# Altium schematic sheet BMS.SchDoc
size A4; SheetNumber: 3; SheetTotal: 5
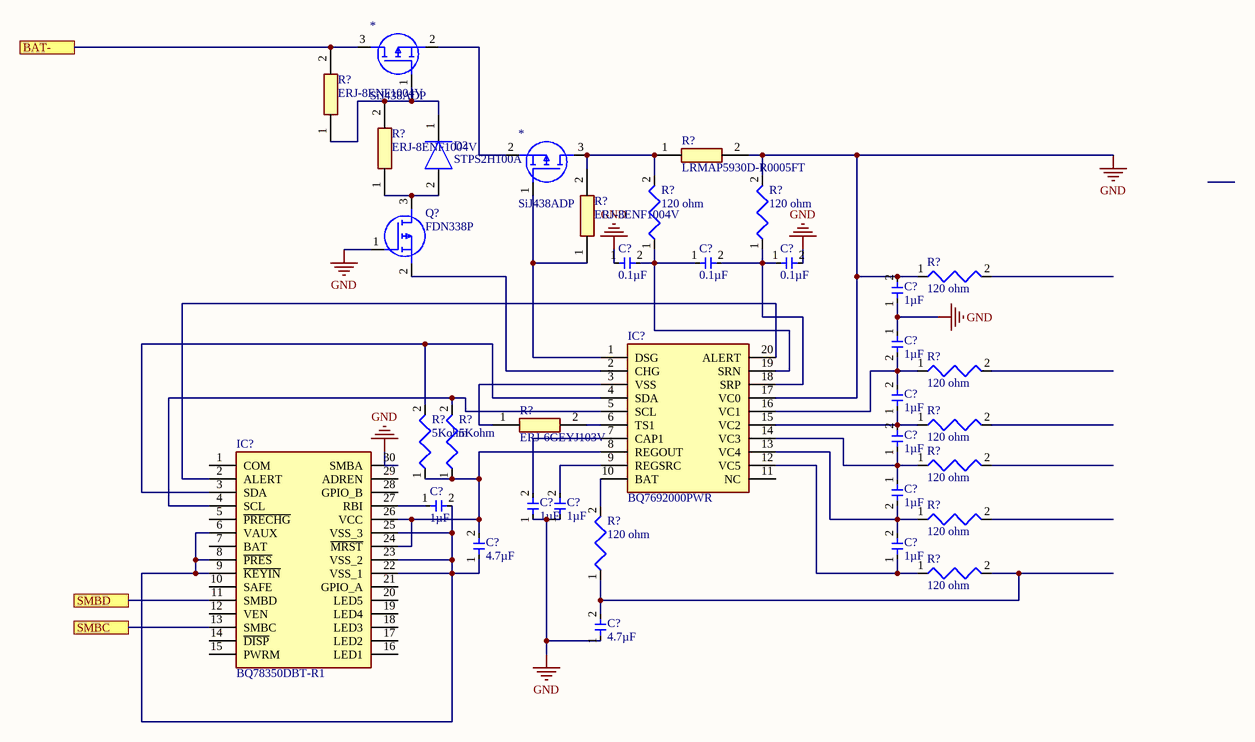
[diagram p0: BMS.SchDoc]

## Parts
(Parts that share a designator on the sheet are numbered #1, #2 ... from top to bottom, then left to right.)
*#1  SiJ438ADP
*#2  SiJ438ADP
C?#1  0.1µF  [0603]
C?#2  0.1µF  [0603]
C?#3  0.1µF  [0603]
C?#4  1µF  [0603]
C?#5  1µF  [0603]
C?#6  1µF  [0603]
C?#7  1µF  [0603]
C?#8  1µF  [0603]
C?#9  1µF  [0603]
C?#10  1µF  [0603]
C?#11  1µF  [0603]
C?#12  4.7µF  [0603]
C?#13  1µF  [0603]
C?#14  4.7µF  [0603]
D?  STPS2H100A  [DIOM5126X265N]
IC?#1  BQ7692000PWR  [SOP65P640X120-20N]
IC?#2  BQ78350DBT-R1  [SOP50P640X120-30N]
Q?  FDN338P  [SOT95P237X112-3N]
R?#1  ERJ-8ENF1004V  [RESC3116X70N]
R?#2  LRMAP5930D-R0005FT  [RESC15078X157N]
R?#3  ERJ-8ENF1004V  [RESC3116X70N]
R?#4  120 ohm  [CRCW0603]
R?#5  120 ohm  [CRCW0603]
R?#6  ERJ-8ENF1004V  [RESC3116X70N]
R?#7  120 ohm  [CRCW0603]
R?#8  120 ohm  [CRCW0603]
R?#9  ERJ-6GEYJ103V  [RESC2012X70N]
R?#10  120 ohm  [CRCW0603]
R?#11  5Kohm  [ERJ-2RK]
R?#12  5Kohm  [ERJ-2RK]
R?#13  120 ohm  [CRCW0603]
R?#14  120 ohm  [CRCW0603]
R?#15  120 ohm  [CRCW0603]
R?#16  120 ohm  [CRCW0603]

## Ports
BAT-, SMBC, SMBD

## Nets
GND: C?#1.1 C?#3.2 C?#4.1 C?#4.2 C?#5.1 C?#10.1 C?#11.1 C?#14.1 IC?#1.17(VC0) IC?#2.30(SMBA) Q?.1(G) R?#2.2 R?#5.2 R?#7.1
BAT-: *#1.3(D) R?#1.2 ; port BAT-
SMBC: IC?#2.13(SMBC) ; port SMBC
SMBD: IC?#2.11(SMBD) ; port SMBD
Net*#1_1: *#1.1(G) D?.1(K) R?#1.1 R?#3.2
Net*#1_2: *#1.2(S) *#2.2(S)
Net*#2_1: *#2.1(G) IC?#1.1(DSG) R?#6.1
Net*#2_3: *#2.3(D) R?#2.1 R?#4.2 R?#6.2
NetC?#1_2: C?#1.2 C?#2.1 IC?#1.19(SRN) R?#4.1
NetC?#2_2: C?#2.2 C?#3.1 IC?#1.18(SRP) R?#5.1
NetC?#5_2: C?#5.2 C?#6.2 IC?#1.16(VC1) R?#8.1
NetC?#6_1: C?#6.1 C?#7.2 IC?#1.15(VC2) R?#10.1
NetC?#7_1: C?#7.1 C?#8.1 IC?#1.14(VC3) R?#13.1
NetC?#8_2: C?#8.2 C?#13.2 IC?#1.13(VC4) R?#14.1
NetC?#9_1: C?#9.1 IC?#2.27(RBI)
NetC?#9_2: C?#9.2 C?#12.1 IC?#2.6(VAUX) IC?#2.8(~{PRES}) IC?#2.9(~{KEYIN}) IC?#2.22(VSS_1) IC?#2.23(VSS_2) IC?#2.25(VSS_3)
NetC?#10_2: C?#10.2 IC?#1.7(CAP1)
NetC?#11_2: C?#11.2 IC?#1.9(REGSRC)
NetC?#12_2: C?#12.2 IC?#1.8(REGOUT) IC?#2.24(~{MRST}) IC?#2.26(VCC) R?#11.1 R?#12.1
NetC?#13_1: C?#13.1 IC?#1.12(VC5) R?#16.1
NetC?#14_2: C?#14.2 R?#15.1 R?#16.2
NetD?_2: D?.2(A) Q?.3(D) R?#3.1
NetIC?#1_2: IC?#1.2(CHG) Q?.2(S)
NetIC?#1_3: IC?#1.3(VSS) R?#9.1
NetIC?#1_4: IC?#1.4(SDA) IC?#2.3(SDA) R?#11.2
NetIC?#1_5: IC?#1.5(SCL) IC?#2.4(SCL) R?#12.2
NetIC?#1_6: IC?#1.6(TS1) R?#9.2
NetIC?#1_10: IC?#1.10(BAT) R?#15.2
NetIC?#1_20: IC?#1.20(ALERT) IC?#2.2(ALERT)

Not connected (* = marked no-connect by the designer): IC?#1 11(NC); IC?#2 1(COM) 5(~{PRECHG}) 7(BAT) 10(SAFE) 12(VEN) 14(~{DISP}) 15(PWRM) 16(LED1) 17(LED2) 18(LED3) 19(LED4) 20(LED5) 21(GPIO_A) 28(GPIO_B) 29(ADREN); R?#7 2; R?#8 2; R?#10 2; R?#13 2; R?#14 2

## Library data of the parts
C?#1-C?#3 = 0603YC104KAT2A: Cap Ceramic 0.1uF 16V X7R 10% SMD 0603 125C Paper T/R; Manufacturer: Kyocera AVX; Capacitance: 100nF; Insulation Resistance: 100GR; Dissipation Factor: 3.5%; Supplier 1: Farnell; Manufacturer Part Number: 0603YC104KAT2A; RoHS: Yes; Category: Ceramic Capacitors; Stock 1: 61599; Pricing 1: 10=0.06680, 100=0.05510, 500=0.03380, 1000=0.02430, 2000=0.02420, 4000=0.01760, 20000=0.01470 (EUR); Mount: Surface Mount,PCB; Case/Package: 0603; Number of Pins: 2; Case Code (Metric): 1608; Case Code (Imperial): 0603; Contact Plating: Tin,Matte; Min Operating Temperature: -55°C; Max Operating Temperature: 125°C; Tolerance: 10%; Dielectric: X7R; Packaging: Tape and Reel; Voltage Rating (DC): 16V; Voltage: 16V; Voltage Rating: 16V; Package Quantity: 1; Termination: SMD/SMT; Series: -; Construction: Flat; Length: 1.6mm; Width: 0.032inch; Height: 0.9mm; Depth: 0.81mm; Thickness: 0.035inch; Radiation Hardening: No; REACH SVHC: No SVHC; Lead Free: Lead Free; RoHS Compliant: Yes; ComponentLink1URL: https://datasheet.ciiva.com/11788/0900766b80dc2409-11788525.pdf?src-supplier=RSComponents; ComponentLink1Description: https://datasheet.ciiva.com/11788/0900766b80dc2409-11788525.pdf?src-supplier=RSComponents; ComponentLink2URL: https://datasheet.ciiva.com/1458/84526-1458128.pdf?src-supplier=Element14; ComponentLink2Description: https://datasheet.ciiva.com/1458/84526-1458128.pdf?src-supplier=Element14; ComponentLink3URL: https://datasheet.ciiva.com/1458/84526-1458129.pdf?src-supplier=Element14; ComponentLink3Description: https://datasheet.ciiva.com/1458/84526-1458129.pdf?src-supplier=Element14; ComponentLink4URL: https://datasheet.ciiva.com/150/cx7r-150230.pdf?src-supplier=Digi-Key; ComponentLink4Description: https://datasheet.ciiva.com/150/cx7r-150230.pdf?src-supplier=Digi-Key; ComponentLink5URL: https://datasheet.ciiva.com/28613/683218-28613286.pdf?src-supplier=Element14; ComponentLink5Description: https://datasheet.ciiva.com/28613/683218-28613286.pdf?src-supplier=Element14; ComponentLink6URL: https://datasheet.ciiva.com/150/cx7r-150231.pdf?src-supplier=Digi-Key; ComponentLink6Description: https://datasheet.ciiva.com/150/cx7r-150231.pdf?src-supplier=Digi-Key; ComponentLink7URL: https://datasheet.ciiva.com/150/cx7r-150232.pdf?src-supplier=Digi-Key; ComponentLink7Description: https://datasheet.ciiva.com/150/cx7r-150232.pdf?src-supplier=Digi-Key; ComponentLink8URL: https://datasheet.ciiva.com/5427/cx7r-218113-5427486.pdf?src-supplier=Mouser; ComponentLink8Description: https://datasheet.ciiva.com/5427/cx7r-218113-5427486.pdf?src-supplier=Mouser; ComponentLink9URL: https://datasheet.ciiva.com/14585/70001075-14585102.pdf?src-supplier=Allied+Electronics; ComponentLink9Description: https://datasheet.ciiva.com/14585/70001075-14585102.pdf?src-supplier=Allied+Electronics; ComponentLink10URL: https://datasheet.ciiva.com/11464/cx7r-11464543.pdf?src-supplier=Avnet; ComponentLink10Description: https://datasheet.ciiva.com/11464/cx7r-11464543.pdf?src-supplier=Avnet; Supplier Part Number 1: 1327679
C?#4-C?#11 C?#13 = 0603YD105KAT2A: AVX - 0603YD105KAT2A - SMD Multilayer Ceramic Capacitor, 1 µF, 16 V, 0603 [1608 Metric], ± 10%, X5R, AVX 0603 MLCC; Manufacturer: Kyocera AVX; Capacitance: 1uF; Voltage Rating: 16V; Dissipation Factor: 12.5%; Insulation Resistance: 10GR; Supplier 1: Farnell; Manufacturer Part Number: 0603YD105KAT2A; RoHS: Yes; Category: Ceramic Capacitors; Stock 1: 33961; Pricing 1: 10=0.07550, 100=0.05170, 500=0.03710, 1000=0.03000, 2000=0.02970, 4000=0.02940, 20000=0.02000 (EUR); Mount: Surface Mount; Case/Package: 0603; Number of Pins: 2; Case Code (Metric): 1608; Case Code (Imperial): 0603; Min Operating Temperature: -55°C; Max Operating Temperature: 85°C; Tolerance: 10%; Dielectric: X5R; Voltage Rating (DC): 16V; Packaging: Tape and Reel; Voltage: 16V; Package Quantity: 1; Termination: SMD/SMT; Series: -; Construction: Flat; Length: 1.6mm; Width: 0.81mm; Height: 0.9mm; Depth: 0.81mm; Thickness: 0.035inch; Radiation Hardening: No; REACH SVHC: No SVHC; Lead Free: Lead Free; RoHS Compliant: Yes; ComponentLink1URL: https://datasheet.ciiva.com/11788/0900766b80def1a5-11788563.pdf?src-supplier=RSComponents; ComponentLink1Description: https://datasheet.ciiva.com/11788/0900766b80def1a5-11788563.pdf?src-supplier=RSComponents; ComponentLink2URL: https://datasheet.ciiva.com/34303/2012654-34303835.pdf?src-supplier=Jameco; ComponentLink2Description: https://datasheet.ciiva.com/34303/2012654-34303835.pdf?src-supplier=Jameco; ComponentLink3URL: https://datasheet.ciiva.com/2987/cx5r-2987890.pdf?src-supplier=Avnet; ComponentLink3Description: https://datasheet.ciiva.com/2987/cx5r-2987890.pdf?src-supplier=Avnet; ComponentLink4URL: https://datasheet.ciiva.com/5412/cx5r-5412550.pdf?src-supplier=Mouser; ComponentLink4Description: https://datasheet.ciiva.com/5412/cx5r-5412550.pdf?src-supplier=Mouser; ComponentLink5URL: https://datasheet.ciiva.com/150/cx5r-150392.pdf?src-supplier=Digi-Key; ComponentLink5Description: https://datasheet.ciiva.com/150/cx5r-150392.pdf?src-supplier=Digi-Key; ComponentLink6URL: https://datasheet.ciiva.com/14590/70001028-14590632.pdf?src-supplier=Allied+Electronics; ComponentLink6Description: https://datasheet.ciiva.com/14590/70001028-14590632.pdf?src-supplier=Allied+Electronics; ComponentLink7URL: https://datasheet.ciiva.com/150/cx5r-150393.pdf?src-supplier=Digi-Key; ComponentLink7Description: https://datasheet.ciiva.com/150/cx5r-150393.pdf?src-supplier=Digi-Key; ComponentLink8URL: https://datasheet.ciiva.com/1458/84508-1458137.pdf?src-supplier=Element14; ComponentLink8Description: https://datasheet.ciiva.com/1458/84508-1458137.pdf?src-supplier=Element14; ComponentLink9URL: https://datasheet.ciiva.com/150/cx5r-150394.pdf?src-supplier=Digi-Key; ComponentLink9Description: https://datasheet.ciiva.com/150/cx5r-150394.pdf?src-supplier=Digi-Key; ComponentLink10URL: https://datasheet.ciiva.com/1458/84508-1458138.pdf?src-supplier=Element14; ComponentLink10Description: https://datasheet.ciiva.com/1458/84508-1458138.pdf?src-supplier=Element14; ComponentLink11URL: https://datasheet.ciiva.com/14586/70001028-14586715.pdf?src-supplier=Allied+Electronics; ComponentLink11Description: https://datasheet.ciiva.com/14586/70001028-14586715.pdf?src-supplier=Allied+Electronics; Supplier Part Number 1: 1327680
C?#12 C?#14 = 0603ZD475KAT2A: AVX - 0603ZD475KAT2A - SMD Multilayer Ceramic Capacitor, 4.7 µF, 10 V, 0603 [1608 Metric], ± 10%, X5R, AVX 0603 MLCC; Manufacturer: Kyocera AVX; Capacitance: 4.7uF; Voltage Rating: 10V; Dissipation Factor: 3.5%; Supplier 1: Farnell; Manufacturer Part Number: 0603ZD475KAT2A; RoHS: Yes; Category: Ceramic Capacitors; Stock 1: 14307; Pricing 1: 10=0.39800, 100=0.22700, 500=0.14700, 1000=0.11700, 2000=0.09810, 4000=0.08400, 20000=0.05250 (EUR); Mount: Surface Mount; Case/Package: 0603; Number of Pins: 2; Case Code (Imperial): 0603; Case Code (Metric): 1608; Contact Plating: Tin,Matte; Min Operating Temperature: -55°C; Max Operating Temperature: 85°C; Tolerance: 10%; Dielectric: X5R; Package Quantity: 1; Voltage Rating (DC): 10V; Packaging: Tape and Reel; Termination: SMD/SMT; Series: -; Voltage: 10V; Construction: Flat; Length: 1.6mm; Width: 0.81mm; Height: 0.9mm; Depth: 0.81mm; Thickness: 0.035inch; Radiation Hardening: No; REACH SVHC: No SVHC; Lead Free: Lead Free; RoHS Compliant: Yes; ComponentLink1URL: https://datasheet.ciiva.com/1458/1796776-1458211.pdf?src-supplier=Element14; ComponentLink1Description: https://datasheet.ciiva.com/1458/1796776-1458211.pdf?src-supplier=Element14; ComponentLink2URL: https://datasheet.ciiva.com/15212/getdatasheetpartid-179504-15212405.pdf?src-supplier=Verical; ComponentLink2Description: https://datasheet.ciiva.com/15212/getdatasheetpartid-179504-15212405.pdf?src-supplier=Verical; ComponentLink3URL: https://datasheet.ciiva.com/11570/cx5r-11570838.pdf?src-supplier=Avnet; ComponentLink3Description: https://datasheet.ciiva.com/11570/cx5r-11570838.pdf?src-supplier=Avnet; ComponentLink4URL: https://datasheet.ciiva.com/6269/cx5r-6269191.pdf?src-supplier=Digi-Key; ComponentLink4Description: https://datasheet.ciiva.com/6269/cx5r-6269191.pdf?src-supplier=Digi-Key; ComponentLink5URL: https://datasheet.ciiva.com/14905/cx5r-14905225.pdf?src-supplier=Digi-Key; ComponentLink5Description: https://datasheet.ciiva.com/14905/cx5r-14905225.pdf?src-supplier=Digi-Key; ComponentLink6URL: https://datasheet.ciiva.com/7855/1666675-7855114.pdf?src-supplier=Element14; ComponentLink6Description: https://datasheet.ciiva.com/7855/1666675-7855114.pdf?src-supplier=Element14; ComponentLink7URL: https://datasheet.ciiva.com/14905/cx5r-14905226.pdf?src-supplier=Digi-Key; ComponentLink7Description: https://datasheet.ciiva.com/14905/cx5r-14905226.pdf?src-supplier=Digi-Key; ComponentLink8URL: https://datasheet.ciiva.com/7614/cx5r-7614716.pdf?src-supplier=Digi-Key; ComponentLink8Description: https://datasheet.ciiva.com/7614/cx5r-7614716.pdf?src-supplier=Digi-Key; ComponentLink9URL: https://datasheet.ciiva.com/28611/1598274-28611548.pdf?src-supplier=Element14; ComponentLink9Description: https://datasheet.ciiva.com/28611/1598274-28611548.pdf?src-supplier=Element14; ComponentLink10URL: https://datasheet.ciiva.com/22700/1796776-22700575.pdf?src-supplier=Element14; ComponentLink10Description: https://datasheet.ciiva.com/22700/1796776-22700575.pdf?src-supplier=Element14; Supplier Part Number 1: 1833806
D? = STPS2H100A: Diode; Manufacturer_Name: STMicroelectronics; Datasheet Link: https://componentsearchengine.com//STPS2H100A.pdf; Height: 2.65mm; Mouser2 Part Number: 511-STPS2H100A; Mouser2 Price/Stock: https://www.mouser.com/Search/Refine.aspx?Keyword=511-STPS2H100A; Manufacturer_Part_Number: STPS2H100A
IC?#1 = BQ7692000PWR: Integrated Circuit; Manufacturer_Name: Texas Instruments; Datasheet Link: http://www.ti.com/lit/gpn/bq76920; Height: 1.2mm; Manufacturer_Part_Number: BQ7692000PWR; Mouser Part Number: 595-BQ7692000PWR; Mouser Price/Stock: https://www.mouser.co.uk/ProductDetail/Texas-Instruments/BQ7692000PWR?qs=%2Fd%252BFzHvH4c0MjFeRoItEJg%3D%3D; Arrow Part Number: BQ7692000PWR; Arrow Price/Stock: https://www.arrow.com/en/products/bq7692000pwr/texas-instruments
IC?#2 = BQ78350DBT-R1: Integrated Circuit; Manufacturer_Name: Texas Instruments; Datasheet Link: http://www.ti.com/lit/ds/symlink/bq78350-r1.pdf; Height: 1.2mm; Manufacturer_Part_Number: BQ78350DBT-R1; Mouser Part Number: 595-BQ78350DBT-R1; Mouser Price/Stock: https://www.mouser.co.uk/ProductDetail/Texas-Instruments/BQ78350DBT-R1?qs=yajEpaT76uQsatHsVfjOmw%3D%3D; Arrow Part Number: BQ78350DBT-R1; Arrow Price/Stock: https://www.arrow.com/en/products/bq78350dbt-r1/texas-instruments
Q? = FDN338P: MOSFET (P-Channel); Manufacturer_Name: ON Semiconductor; Height: 1.12mm; Manufacturer_Part_Number: FDN338P
R?#1 R?#3 R?#6 = ERJ-8ENF1004V: Resistor; Manufacturer_Name: Panasonic; Datasheet Link: https://industrial.panasonic.com/cdbs/www-data/pdf/RDA0000/AOA0000C86.pdf; Height: 0.7mm; Manufacturer_Part_Number: ERJ-8ENF1004V
R?#2 = LRMAP5930D-R0005FT: Resistor; Manufacturer_Name: TT ELECTRONICS / WELWYN; Datasheet Link: https://componentsearchengine.com/Datasheets/2/LRMAP5930D-R0005FT.pdf; Height: 1.57mm; Manufacturer_Part_Number: LRMAP5930D-R0005FT
R?#4 R?#5 R?#7 R?#8 R?#10 R?#13-R?#16 = CRCW0603120RFKEA: Res Thick Film 0603 120 Ohm 1% 1/10W ±100ppm/°C Molded SMD Paper T/R; Manufacturer: Vishay; Resistance: 120R; Max Power Dissipation: 100mW; Voltage Rating: 75V; Supplier 1: Farnell; Manufacturer Part Number: CRCW0603120RFKEA; RoHS: Yes; Category: Chip SMD Resistors; Stock 1: 98285; Pricing 1: 10=0.02730, 100=0.01530, 500=0.01020, 1000=0.00500, 2500=0.00450, 5000=0.00390, 25000=0.00330 (EUR); Mount: Surface Mount; Case/Package: 0603; Case Code (Metric): 1608; Case Code (Imperial): 0603; Contact Plating: Tin; Weight: 7.1E-05oz; Min Operating Temperature: -55°C; Max Operating Temperature: 155°C; Tolerance: 1%; Resistor Type: Thick Film; Temperature Coefficient: 100ppm/°C; Packaging: Tape and Reel; Number of Terminations: 2; Package Quantity: 10; Power Rating: 100mW; Termination: SMD/SMT; Features: Automotive AEC-Q200; Series: CRCW; Technology: THICK FILM; Construction: Rectangular; Resistance Tolerance: 1%; Voltage Rating (DC): 75V; Working Voltage: 75V; Length: 1.55mm; Width: 0.033inch; Height: 0.45mm; Depth: 0.85mm; Radiation Hardening: No; RoHS Compliant: Yes; REACH SVHC: Unknown; Military Standard: Not; Lead Free: Lead Free; ComponentLink1URL: https://datasheet.ciiva.com/11811/0900766b80d98afc-11811523.pdf?src-supplier=RSComponents; ComponentLink1Description: https://datasheet.ciiva.com/11811/0900766b80d98afc-11811523.pdf?src-supplier=RSComponents; ComponentLink2URL: https://datasheet.ciiva.com/2513/dcrcwe3-2513575.pdf?src-supplier=Digi-Key; ComponentLink2Description: https://datasheet.ciiva.com/2513/dcrcwe3-2513575.pdf?src-supplier=Digi-Key; ComponentLink3URL: https://datasheet.ciiva.com/2513/dcrcwe3-2513576.pdf?src-supplier=Digi-Key; ComponentLink3Description: https://datasheet.ciiva.com/2513/dcrcwe3-2513576.pdf?src-supplier=Digi-Key; ComponentLink4URL: https://datasheet.ciiva.com/26316/fld-crcw-e3-data-en-26316568.pdf?src-supplier=Distrelec; ComponentLink4Description: https://datasheet.ciiva.com/26316/fld-crcw-e3-data-en-26316568.pdf?src-supplier=Distrelec; ComponentLink5URL: https://datasheet.ciiva.com/2513/dcrcwe3-2513577.pdf?src-supplier=Digi-Key; ComponentLink5Description: https://datasheet.ciiva.com/2513/dcrcwe3-2513577.pdf?src-supplier=Digi-Key; ComponentLink6URL: https://datasheet.ciiva.com/5544/dcrcwe3-109170-5544139.pdf?src-supplier=Mouser; ComponentLink6Description: https://datasheet.ciiva.com/5544/dcrcwe3-109170-5544139.pdf?src-supplier=Mouser; ComponentLink7URL: https://datasheet.ciiva.com/7777/1533075-7777275.pdf?src-supplier=Element14; ComponentLink7Description: https://datasheet.ciiva.com/7777/1533075-7777275.pdf?src-supplier=Element14; ComponentLink8URL: https://datasheet.ciiva.com/7777/1697337-7777276.pdf?src-supplier=Element14; ComponentLink8Description: https://datasheet.ciiva.com/7777/1697337-7777276.pdf?src-supplier=Element14; ComponentLink9URL: https://datasheet.ciiva.com/16725/70201119-16725181.pdf?src-supplier=Allied+Electronics; ComponentLink9Description: https://datasheet.ciiva.com/16725/70201119-16725181.pdf?src-supplier=Allied+Electronics; Supplier Part Number 1: 1652832
R?#9 = ERJ-6GEYJ103V: Resistor; Manufacturer_Name: Panasonic; Height: 0.7mm; Manufacturer_Part_Number: ERJ-6GEYJ103V
R?#11 R?#12 = ERJ-2RKF4991X: Res Thick Film 0402 4.99K Ohm 1% 1/10W +/-100ppm/ßC Molded SMD Punched Carrier T/R; Manufacturer: Panasonic; Resistance: 4.99kR; Power Rating: 100mW; Voltage Rating: 50V; Temperature Coefficient: 100ppm/°C; Supplier 1: Farnell; Manufacturer Part Number: ERJ-2RKF4991X; RoHS: Yes; Category: Chip SMD Resistors; Stock 1: 164767; Pricing 1: 10=0.01960, 100=0.00930, 500=0.00630, 2500=0.00570, 5000=0.00530, 10000=0.00490, 50000=0.00440 (EUR); Mount: Surface Mount; Case/Package: 0402; Case Code (Metric): 1005; Case Code (Imperial): 0402; Weight: 2.8E-05oz; Contact Plating: Tin; Min Operating Temperature: -55°C; Max Operating Temperature: 155°C; Tolerance: 1%; Packaging: Tape and Reel; Package Quantity: 1; Resistor Type: Thick Film; Number of Terminations: 2; Termination: SMD/SMT; Max Power Dissipation: 100mW; Voltage Rating (DC): 50V; Working Voltage: 50V; Features: Automotive AEC-Q200; Series: ERJ; Resistance Tolerance: 1%; Technology: THICK FILM; Construction: Rectangular; Length: 1mm; Width: 0.02inch; Height: 0.016inch; Depth: 0.5mm; Radiation Hardening: No; REACH SVHC: No SVHC; Military Standard: Not; Lead Free: Lead Free; RoHS Compliant: Yes; ComponentLink1URL: https://datasheet.ciiva.com/16773/70260748-16773110.pdf?src-supplier=Allied+Electronics; ComponentLink1Description: https://datasheet.ciiva.com/16773/70260748-16773110.pdf?src-supplier=Allied+Electronics; ComponentLink2URL: https://datasheet.ciiva.com/22749/1678782-22749654.pdf?src-supplier=Element14; ComponentLink2Description: https://datasheet.ciiva.com/22749/1678782-22749654.pdf?src-supplier=Element14; ComponentLink3URL: https://datasheet.ciiva.com/24158/aoa0000ce2-24158871.pdf?src-supplier=Mouser; ComponentLink3Description: https://datasheet.ciiva.com/24158/aoa0000ce2-24158871.pdf?src-supplier=Mouser; ComponentLink4URL: https://datasheet.ciiva.com/46388/426256-46388311.pdf?src-supplier=Element14; ComponentLink4Description: https://datasheet.ciiva.com/46388/426256-46388311.pdf?src-supplier=Element14; ComponentLink5URL: https://datasheet.ciiva.com/16199/aoa0000ce2-16199546.pdf?src-supplier=Future+Electronics; ComponentLink5Description: https://datasheet.ciiva.com/16199/aoa0000ce2-16199546.pdf?src-supplier=Future+Electronics; ComponentLink6URL: https://datasheet.ciiva.com/16775/70260748-16775018.pdf?src-supplier=Allied+Electronics; ComponentLink6Description: https://datasheet.ciiva.com/16775/70260748-16775018.pdf?src-supplier=Allied+Electronics; ComponentLink7URL: https://datasheet.ciiva.com/46376/426256-46376955.pdf?src-supplier=Element14; ComponentLink7Description: https://datasheet.ciiva.com/46376/426256-46376955.pdf?src-supplier=Element14; ComponentLink8URL: https://datasheet.ciiva.com/48530/aoa0000ce2-48530971.pdf?src-supplier=Avnet; ComponentLink8Description: https://datasheet.ciiva.com/48530/aoa0000ce2-48530971.pdf?src-supplier=Avnet; Supplier Part Number 1: 2059145